# EAGLE design final schematic power consumption board (EAGLE 9.3.1)
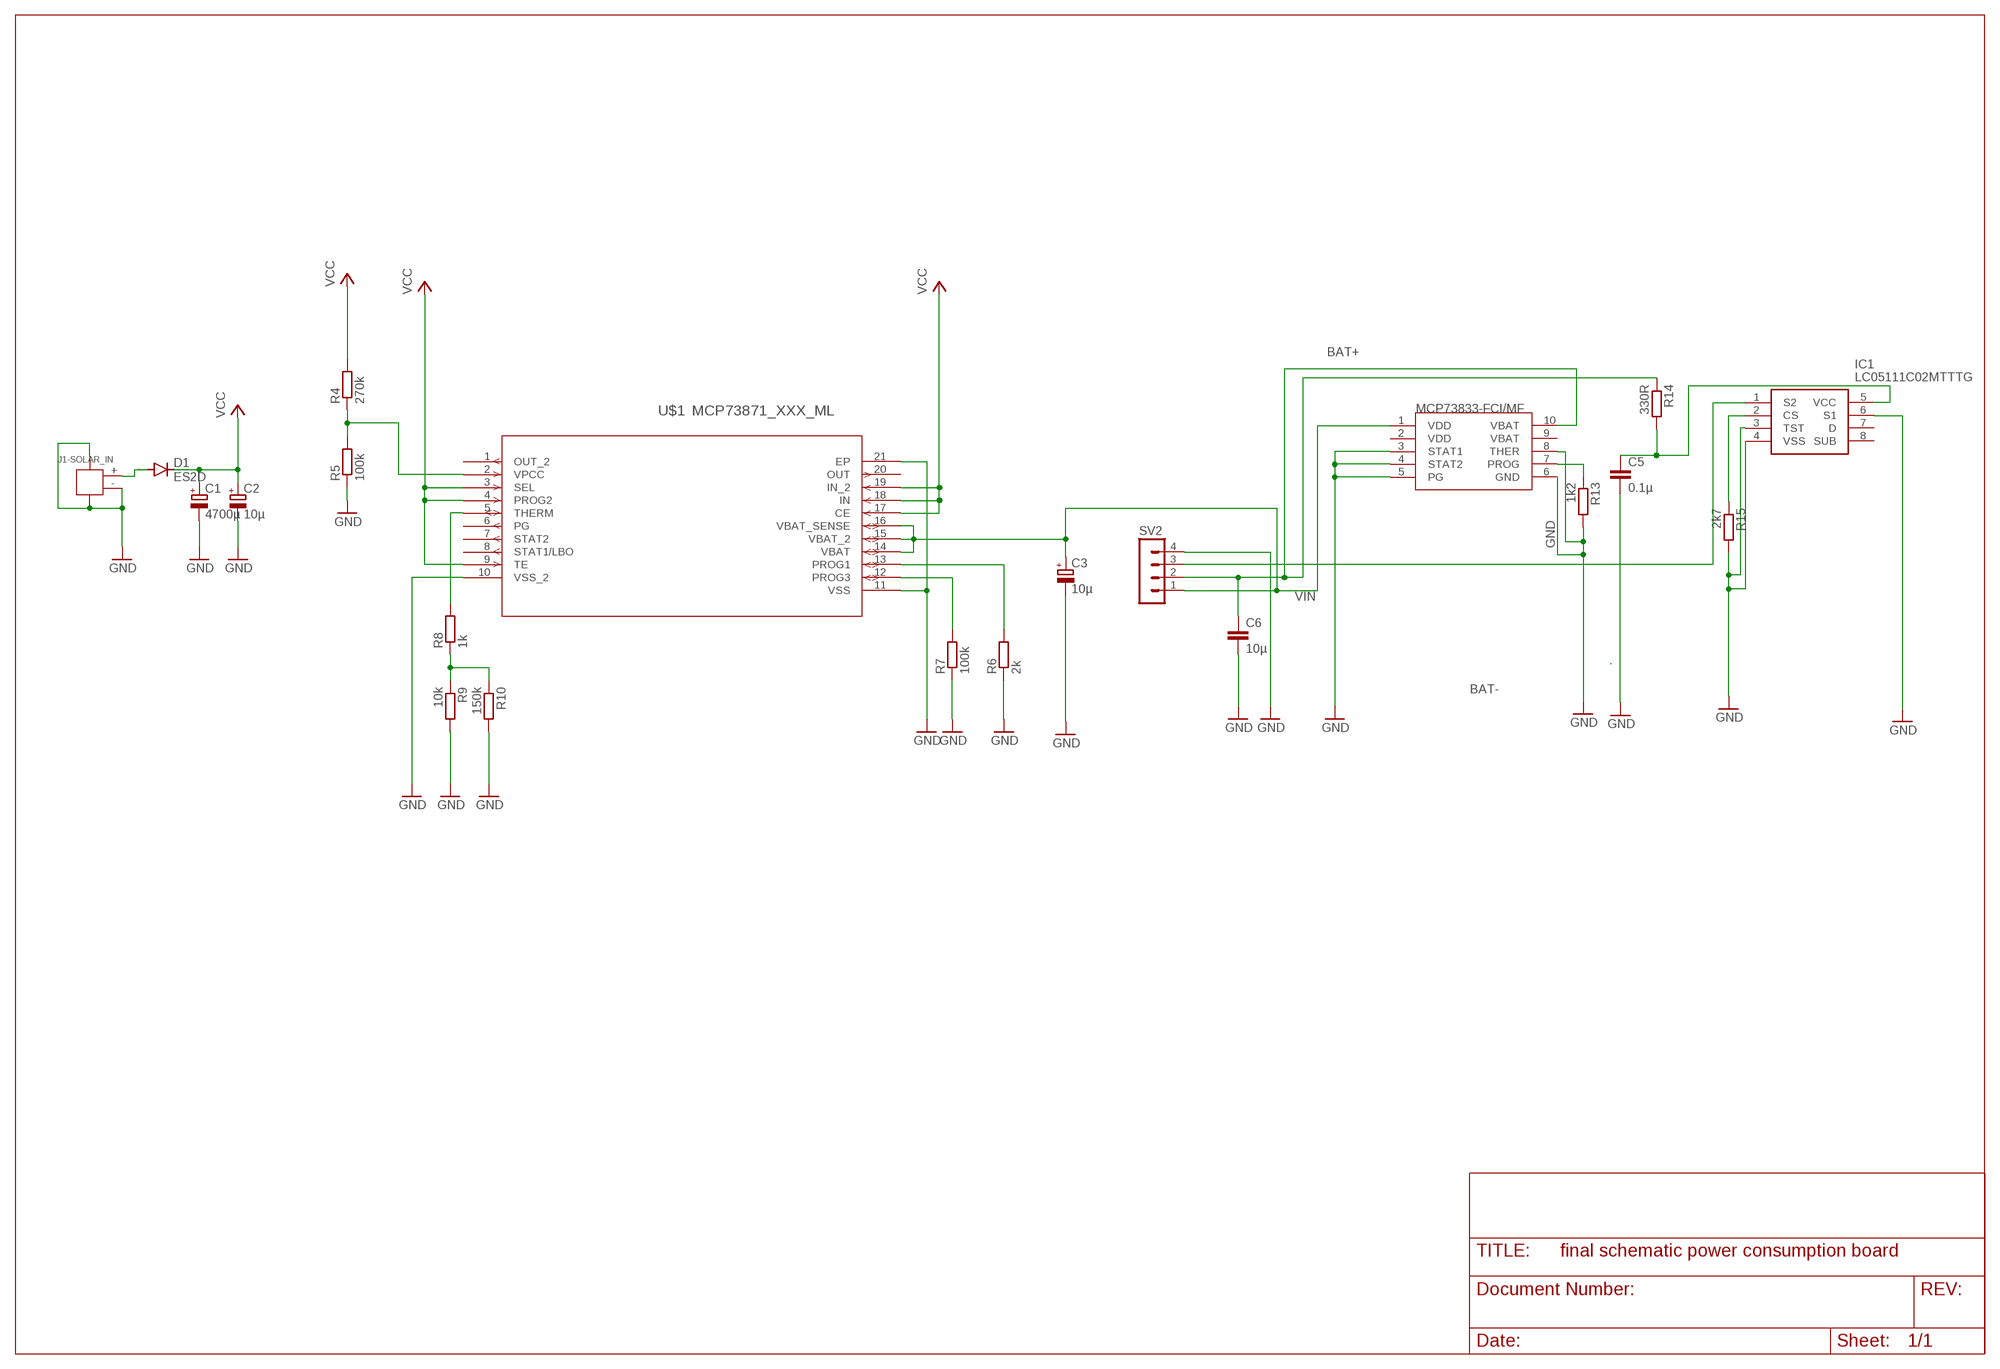
[diagram p0: schematic, sheet 1]

## Parts
C1  4700µ  CPOL-EU153CLV-0505  [153CLV-0505]
C2  10µ  CPOL-EU153CLV-0505  [153CLV-0505]
C3  10µ  CPOL-EU153CLV-0505  [153CLV-0505]
C5  0.1µ  C-EUC1206  [C1206]
C6  10µ  C-EUC1206  [C1206]
D1  ES2D  [SMB]
IC1  LC05111C02MTTTG  [LC05111C02MTTTG]
J1-SOLAR_IN  CONN-HEADER-SMD-PH-SIDE-(2P-2.0MM)  [HW2-SMD-2.0-90D]
R4  270k  R-EU_R0603  [R0603]
R5  100k  R-EU_R0603  [R0603]
R6  2k  R-EU_R0603  [R0603]
R7  100k  R-EU_R0603  [R0603]
R8  1k  R-EU_R0603  [R0603]
R9  10k  R-EU_R0603  [R0603]
R10  150k  R-EU_R0603  [R0603]
R13  1k2  R-EU_R1206W  [R1206W]
R14  330R  R-EU_R1206W  [R1206W]
R15  2k7  R-EU_R1206W  [R1206W]
SV2  MA04-1  [MA04-1]
U$1  MCP73871_XXX_ML  [QFN20_4X4MC]
U$3  MCP73833-FCI/MF  [SOP50P490X110-10N]

## Nets
BAT+: C6.1 R14.1 SV2.2 U$3.10(VBAT)
BAT-: IC1.1(S2) SV2.3
GND: C1.- C2.- C3.- C5.2 C6.2 IC1.3(TST) IC1.4(VSS) IC1.6(S1) J1-SOLAR_IN.3 J1-SOLAR_IN.4 J1-SOLAR_IN.- R5.1 R6.1 R7.1 R9.2 R10.2 R13.2 R15.2 SV2.4 U$1.10(VSS_2) U$1.11(VSS) U$1.21(EP) U$3.3(STAT1) U$3.4(STAT2) U$3.5(PG) U$3.6(GND) U$3.8(THER)
N$3: R13.1 U$3.7(PROG)
N$7: R4.1 R5.2 U$1.2(VPCC)
N$8: R7.2 U$1.12(PROG3)
N$9: R8.1 R9.1 R10.1
N$10: R6.2 U$1.13(PROG1)
N$13: D1.A J1-SOLAR_IN.+
N$14: R8.2 U$1.5(THERM)
N$18: C5.1 IC1.5(VCC) R14.2
N$19: IC1.2(CS) R15.1
VCC: C1.+ C2.+ D1.C R4.2 U$1.3(SEL) U$1.4(PROG2) U$1.9(TE) U$1.17(CE) U$1.18(IN) U$1.19(IN_2)
VIN: C3.+ SV2.1 U$1.14(VBAT) U$1.15(VBAT_2) U$1.16(VBAT_SENSE) U$3.1(VDD)
Unconnected: IC1.7(D) IC1.8(SUB) U$1.1(OUT_2) U$1.6(PG) U$1.7(STAT2) U$1.8(STAT1/LBO) U$1.20(OUT) U$3.2(VDD) U$3.9(VBAT)

## Library data of the parts
C1-C3 = rcl:CPOL-EU: POLARIZED CAPACITOR, European symbol; SPICEPREFIX: C
C5 C6 = rcl:C-EU: CAPACITOR, European symbol; SPICEPREFIX: C
D1 = diode:ES2D: DIODE super fast rectifier, 2 A
IC1 = LC05111C02MTTTG:LC05111C02MTTTG: Battery Management 1 CELL LIB PROTECTION IC Source: Datasheet <http://www.onsemi.com/pub/Collateral/LC05111CMT-D.PDF>; ALLIED_NUMBER: 70547338; ALLIED_PRICE-STOCK: https://www.alliedelec.com/onsemiconductor-lc05111c02mtttg/70547338/; DESCRIPTION: Battery Management 1 CELL LIB PROTECTION IC; HEIGHT: 0.8mm; MANUFACTURER_NAME: ON Semiconductor; MANUFACTURER_PART_NUMBER: LC05111C02MTTTG; MOUSER_PART_NUMBER: 863-LC05111C02MTTTG; MOUSER_PRICE-STOCK: https://www.mouser.com/Search/Refine.aspx?Keyword=863-LC05111C02MTTTG; RS_PART_NUMBER: 8427787P; RS_PRICE-STOCK: http://uk.rs-online.com/web/p/products/8427787P
J1-SOLAR_IN = connectors2:CONN-HEADER-SMD-PH-SIDE-(2P-2.0MM): 320110026; VALUE: 2P-2.0-90D-SMD
R4-R10 R13-R15 = rcl:R-EU_: RESISTOR, European symbol; SPICEPREFIX: R
SV2 = con-lstb:MA04-1: PIN HEADER; OC_FARNELL: unknown; OC_NEWARK: unknown
U$1 = MCP73871:MCP73871_XXX_ML
U$3 = SON50P300X300X100-11N:MCP73833-FCI/MF

## Board
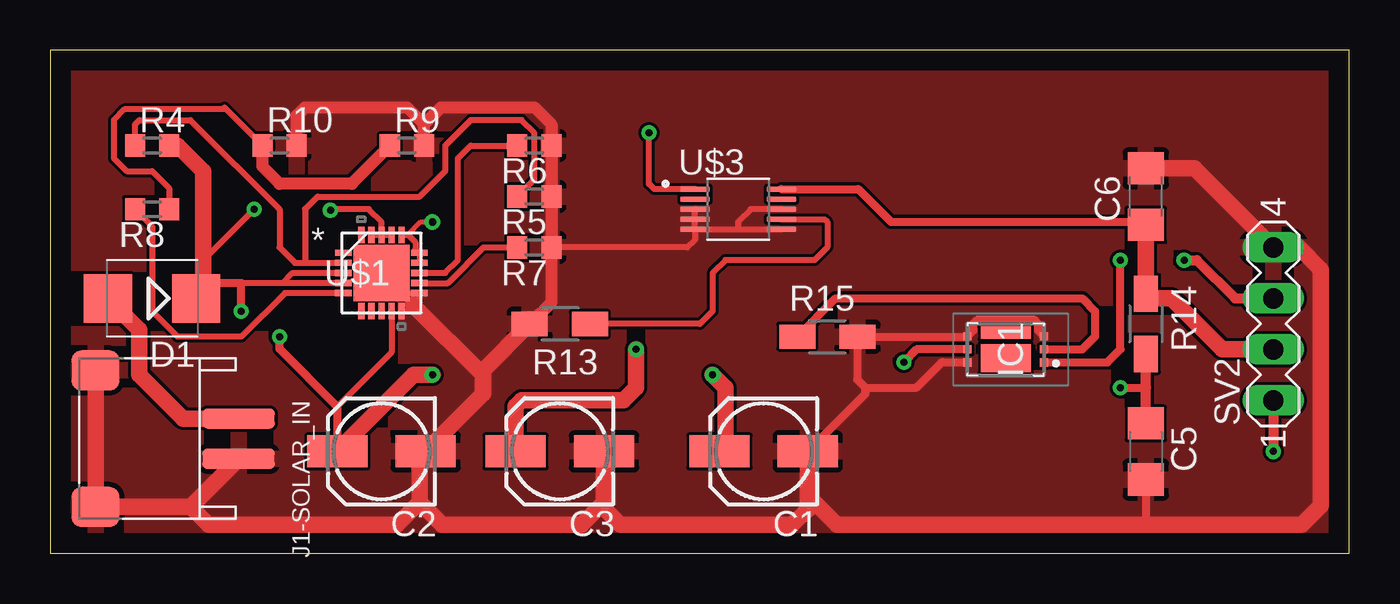
[diagram p1: board, top side]
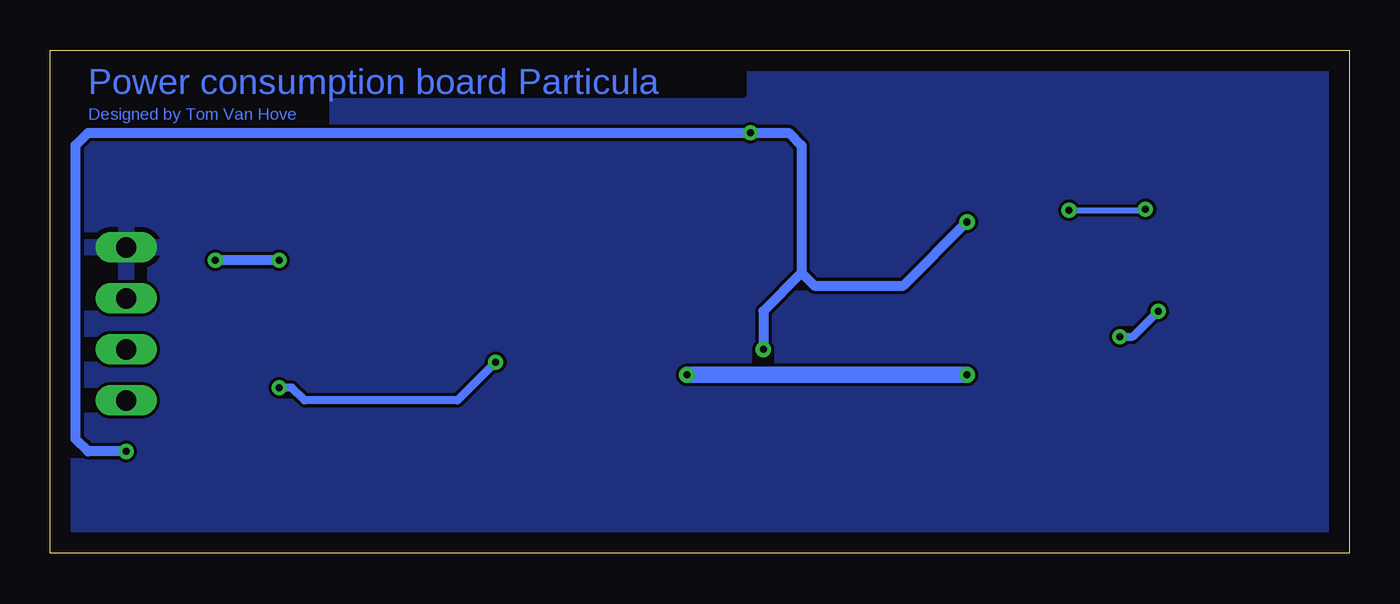
[diagram p2: board, bottom side, seen from below]

Size 64.75 x 25.07 mm. Coordinates in mm from the lower left corner, seen from the top.
Outline: 0,0 64.75,0 64.75,25.07 0,25.07 0,0
Copper layers (1*16): Top 0.035mm / dielectric 1.5mm / Bottom 0.035mm
Design rules "default": minimum track width 6mil, minimum drill 0.35mm, track to track 6mil, track to pad 6mil, pad to pad 6mil, via to via 6mil, smd to smd 6mil, copper to edge 40mil, drill to drill 6mil, minimum pad ring 10mil, minimum via ring 8mil, stop-mask expansion 4mil, vias tented up to drill 0mil, thermal gap 10mil

### Footprints (pad centres in the part's own frame; a part is rotated, then mirrored left to right if it is on the bottom)
153CLV-0505 = smd 3 x 1.6: + 2.2,0; - -2.2,0
C1206 = smd 1.6 x 1.8: 1 -1.4,0; 2 1.4,0
SMB = smd 2.4 x 2.4: A 2.2,0; C -2.2,0
LC05111C02MTTTG = smd 0.4 x 0.4: 1 -0.65,-1.9; 2 0,-1.9; 3 0.65,-1.9; 4 0.65,1.9; 5 0,1.9; 6 -0.65,1.9 | smd 1.415 x 2.5: 7 -0.438,0 | smd 0.615 x 2.5: 8 0.837,0
HW2-SMD-2.0-90D = smd 2 x 2.4: 3 3.4,-2.181; 4 -3.4,-2.181 | smd 1 x 3.6: + -1,4.953; - 1,4.953
R0603 = smd 1 x 1.1: 1 -0.85,0; 2 0.85,0
R1206W = smd 1.8 x 1.2: 1 -1.499,0; 2 1.499,0
MA04-1 = drill 1.016 long: 1 -3.81,0; 2 -1.27,0; 3 1.27,0; 4 3.81,0
QFN20_4X4MC = smd 0.813 x 0.305: 1 -1.892,1; 2 -1.892,0.5; 3 -1.892,0; 4 -1.892,-0.5; 5 -1.892,-1; 11 1.892,-1; 12 1.892,-0.5; 13 1.892,0; 14 1.892,0.5; 15 1.892,1 | smd 0.305 x 0.813: 6 -1,-1.892; 7 -0.5,-1.892; 8 0,-1.892; 9 0.5,-1.892; 10 1,-1.892; 16 1,1.892; 17 0.5,1.892; 18 0,1.892; 19 -0.5,1.892; 20 -1,1.892 | smd 2.794 x 2.794: 21 0,0
SOP50P490X110-10N = smd 1.47 x 0.28: 1 -2.15,1; 2 -2.15,0.5; 3 -2.15,0; 4 -2.15,-0.5; 5 -2.15,-1; 6 2.15,-1; 7 2.15,-0.5; 8 2.15,0; 9 2.15,0.5; 10 2.15,1

### Placement (x,y rotation side)
C1  35.56,5.08 180 top
C2  16.51,5.08 180 top
C3  25.4,5.08 180 top
C5  54.61,5.08 270 top
C6  54.61,17.78 90 top
D1  5.08,12.7 180 top
IC1  47.62,10.16 90 top
J1-SOLAR_IN  4.45,5.71 270 top
R4  5.08,20.32 0 top
R5  24.13,17.78 180 top
R6  24.13,20.32 180 top
R7  24.13,15.24 180 top
R8  5.08,17.14 180 top
R9  17.78,20.32 0 top
R10  11.43,20.32 0 top
R13  25.4,11.43 180 top
R14  54.61,11.43 270 top
R15  38.73,10.79 0 top
SV2  60.96,11.43 90 top
U$1  16.51,13.97 0 top
U$3  34.29,17.14 0 top

### Tracks (layer width: path | path; a pad name or v marks a point on that pad's centre or on a via)
BAT+
  Top 0.406: U$3.10 40.27,18.14 41.91,16.51 54.48,16.51
  Top 0.813: C6.1 R14.1 54.84,12.7 55.88,12.7 58.42,10.16 SV2.2
  Top 1.016: 54.48,16.51 C6.1
BAT-  (via drill 0.35)
  Top 0.406: IC1.1 52.69,9.51 53.34,10.16 v53.34,14.61
  Top 0.508: v56.52,14.61 57.15,14.61 59.05,12.7 SV2.3
  Bottom 0.508: v53.34,14.61 v56.52,14.61
GND
  Top 0.305: U$1.10 17.79,12.08 18.1,12.38 18.41,12.7 18.4,12.71 U$1.11 17.51,12.97 U$1.21 | 21.57,9.1 21.38,9.1 | U$3.5 U$3.4 U$3.3 | U$3.5 32.14,15.63 31.75,15.24 R7.1 | U$3.5 34.29,16.14 | 34.29,16.14 U$3.6 | U$3.8 34.92,17.14 34.29,16.51 34.29,16.14
  Top 0.406: IC1.3 49.23,11.1 49.23,11.45 49.02,11.66 46.23,11.66 46.02,11.45 46.02,11.1 IC1.4 45.71,10.79 R15.2 40.23,8.66 40.64,8.26 | 40.64,8.26 43.18,8.26 44.45,9.53 45.71,9.53 IC1.6 | C1.- 40.64,7.96 40.64,8.26 | C5.2 54.61,1.42
  Top 0.61: R10.2 12.28,21.8 12.7,22.23 17.78,22.23 18.63,21.38 | R9.2 18.63,21.38 | 18.63,21.38 19.48,22.23 24.13,22.23 24.98,21.38 R6.1 R5.1 R7.1 24.98,12.51 R13.2
  Top 0.813: J1-SOLAR_IN.4 J1-SOLAR_IN.3 7,2.31 | C6.2 57.02,19.18 SV2.4 62.23,15.24 63.33,14.14 63.33,2.37 62.38,1.42 54.61,1.42 39.22,1.42 37.76,2.88 C1.- 37.76,2.2 36.98,1.42 28.42,1.42 27.6,2.25 27.6,2.54 | 23.9,11.66 R13.2 21.57,9.1 21.57,8.89 | 21.57,8.89 18.1,12.37 18.1,12.38 | 7,2.31 J1-SOLAR_IN.- | 7,2.31 7.89,1.42 17.3,1.42 18.41,2.54 | 27.6,2.54 C3.- | 27.6,2.54 26.48,1.42 19.53,1.42 18.41,2.54 | 18.41,2.54 18.41,4.45 17.78,5.08 C2.- 21.57,7.95 21.57,8.89
  pour Bottom: 0,0 0,24.77 64.77,24.77 64.77,0
  pour Top: 0,0 0,24.77 64.77,24.77 64.77,0
N$3
  Top 0.305: U$3.7 38.6,16.64 38.73,16.51 38.73,15.24 38.1,14.61 33.66,14.61 33.02,13.97 33.02,12.06 32.38,11.43 R13.1
N$7
  Top 0.305: 12.7,14.47 U$1.2 | R5.2 24.13,18.63 24.13,20.95 | 24.13,20.95 | 12.7,14.47 12.7,17.14 13.34,17.78 18.41,17.78 19.68,19.05 19.68,20.32 20.95,21.59 23.5,21.59 24.13,20.95 | 12.7,14.47 12.2,14.47 11.43,15.24 11.43,17.14 6.99,21.59 4.45,21.59 4.23,21.38 R4.1
N$8
  Top 0.305: U$1.12 19.83,13.47 20.78,14.42 20.78,14.43 21.59,15.24 R7.2
N$9
  Top 0.305: 8.68,22.23 8.78,22.12 | 8.78,22.12 R10.1 | 8.78,22.12 3.7,22.12 3.17,21.59 3.17,19.68 3.81,19.05 5.08,19.05 5.93,18.2 R8.1
  Top 0.61: R9.1 15.03,18.41 11.43,18.41 10.58,19.27 R10.1
N$10
  Top 0.305: U$1.13 19.68,13.97 20.32,14.61 20.32,19.68 20.95,20.32 R6.2
N$13
  Top 0.813: J1-SOLAR_IN.+ 6.62,6.71 4.45,8.89 4.45,11.13 D1.A
N$14
  Top 0.305: U$1.5 11.7,12.97 9.53,10.79 6.35,10.79 5.08,12.06 5.08,16.3 R8.2 4.23,16.73
N$18  (via drill 0.35)
  Top 0.406: v42.55,9.53 43.18,10.16 IC1.5 | v53.34,8.26 54.61,8.26
  Top 0.508: C5.1 54.61,8.26 R14.2
  Bottom 0.406: v42.55,9.53 44.45,7.62 52.07,7.62 52.7,8.26 v53.34,8.26
N$19
  Top 0.305: R15.1 37.47,10.57
  Top 0.406: IC1.2 51.44,10.16 52.07,10.79 52.07,12.06 51.44,12.7 39.14,12.7 R15.1
VCC  (via drill 0.35)
  Top 0.305: U$1.18 16.51,16.51 15.88,17.14 13.97,17.14 v13.97,17.1 | v10.16,17.14 7.62,14.61 7.62,13.97 | U$1.19 U$1.18 | U$1.18 U$1.17 | U$1.4 11.56,13.47 | 11.56,13.47 9.53,13.47 9.53,13.48 | 11.56,13.47 12.06,13.97 U$1.3 | U$1.9 17.01,10.01 14.31,7.31
  Top 0.406: D1.C 7.45,12.87 8.06,13.48 9.53,13.48 v9.53,12.06 | C2.+ 14.31,7.31 11.43,10.19 v11.43,10.79
  Top 0.813: 7.45,12.87 7.62,13.04 7.62,13.97 7.62,19.05 6.35,20.32 R4.2 | C2.+ 18.12,8.89 v19.05,8.89 | v33.02,8.89 33.66,8.26 33.66,5.08 C1.+
  Bottom 0.305: v13.97,17.1 10.21,17.1 v10.16,17.14
  Bottom 0.406: v11.43,10.79 10.79,10.79 v9.53,12.06
  Bottom 0.813: v19.05,8.89 v33.02,8.89
VIN  (via drill 0.35)
  Top 0.254: 17.83,15.88 18.46,16.51 v19.05,16.51
  Top 0.305: U$1.16 17.52,15.88 17.83,15.88 18.21,15.49 18.21,15.16 U$1.15 U$1.14 | U$3.1 30.11,18.14 29.84,18.41 v29.84,20.95
  Top 0.508: SV2.1 v60.96,5.08
  Top 0.813: C3.+ 23.2,7.33 23.5,7.62 28.57,7.62 29.21,8.26 v29.21,10.16
  Bottom 0.508: v60.96,5.08 62.87,5.08 63.48,5.7 63.48,20.34 62.87,20.95 v29.84,20.95 27.94,20.95 27.3,20.32 27.3,13.97 | 27.3,13.97 26.67,13.34 22.23,13.34 v19.05,16.51 | 27.3,13.97 29.21,12.06 v29.21,10.16

### Text on the board
Bottom: Power consumption board Particula | Designed by Tom Van Hove